# EAGLE schematic st32 (EAGLE 6.5.0)

## Sheet 1 of 3: IC mit Kommunikation
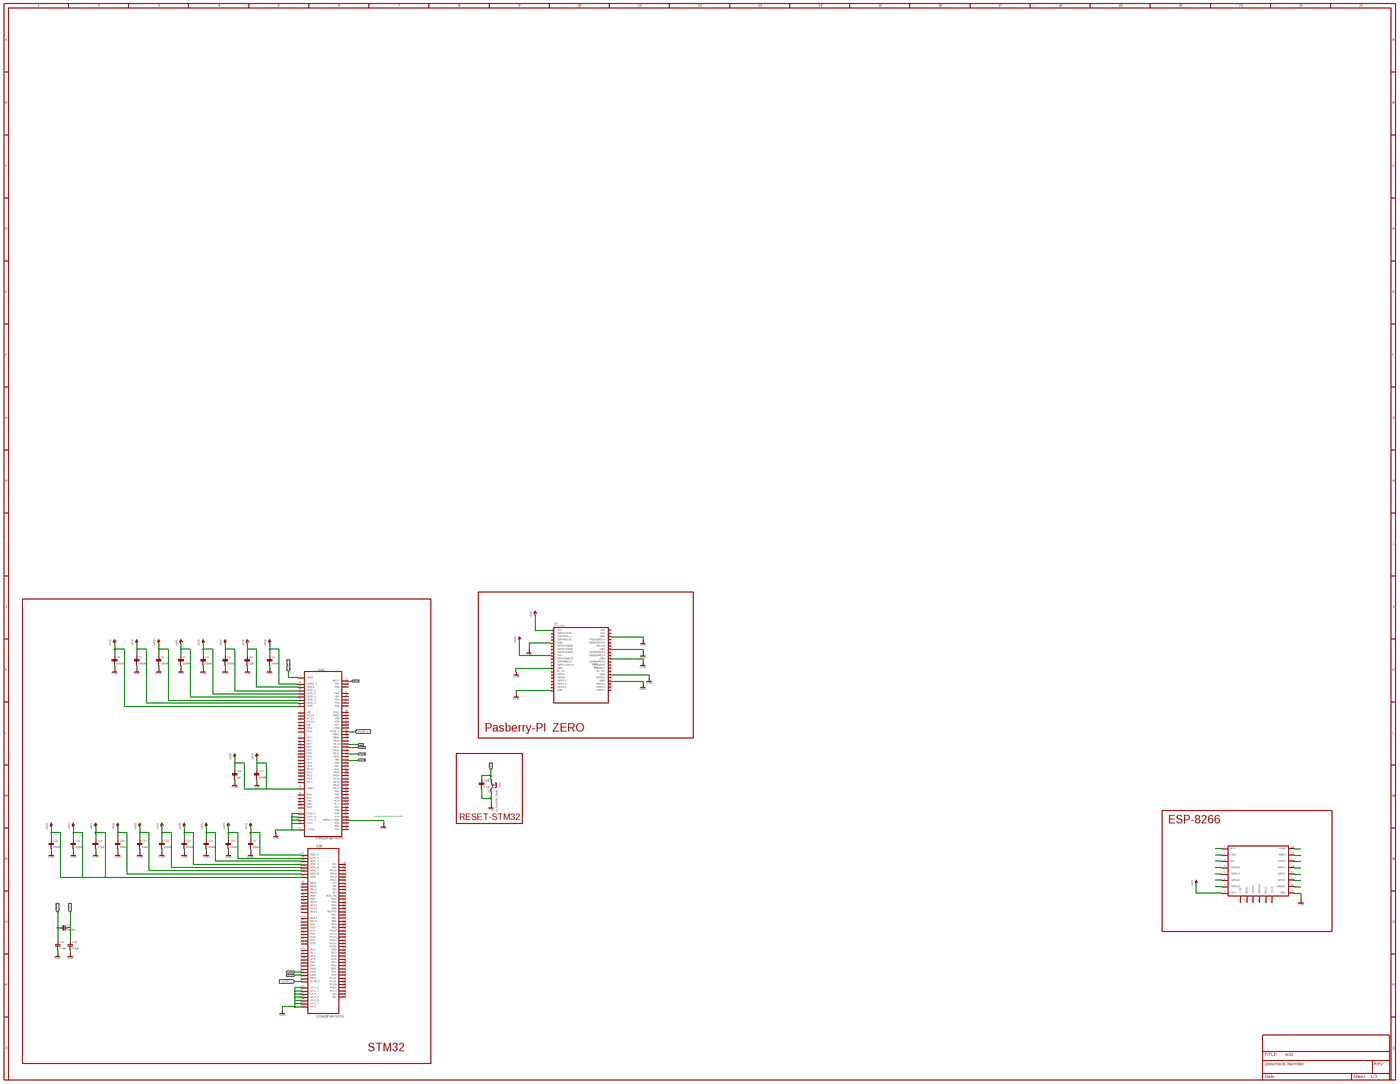
[diagram p0: schematic, sheet 1, overview]
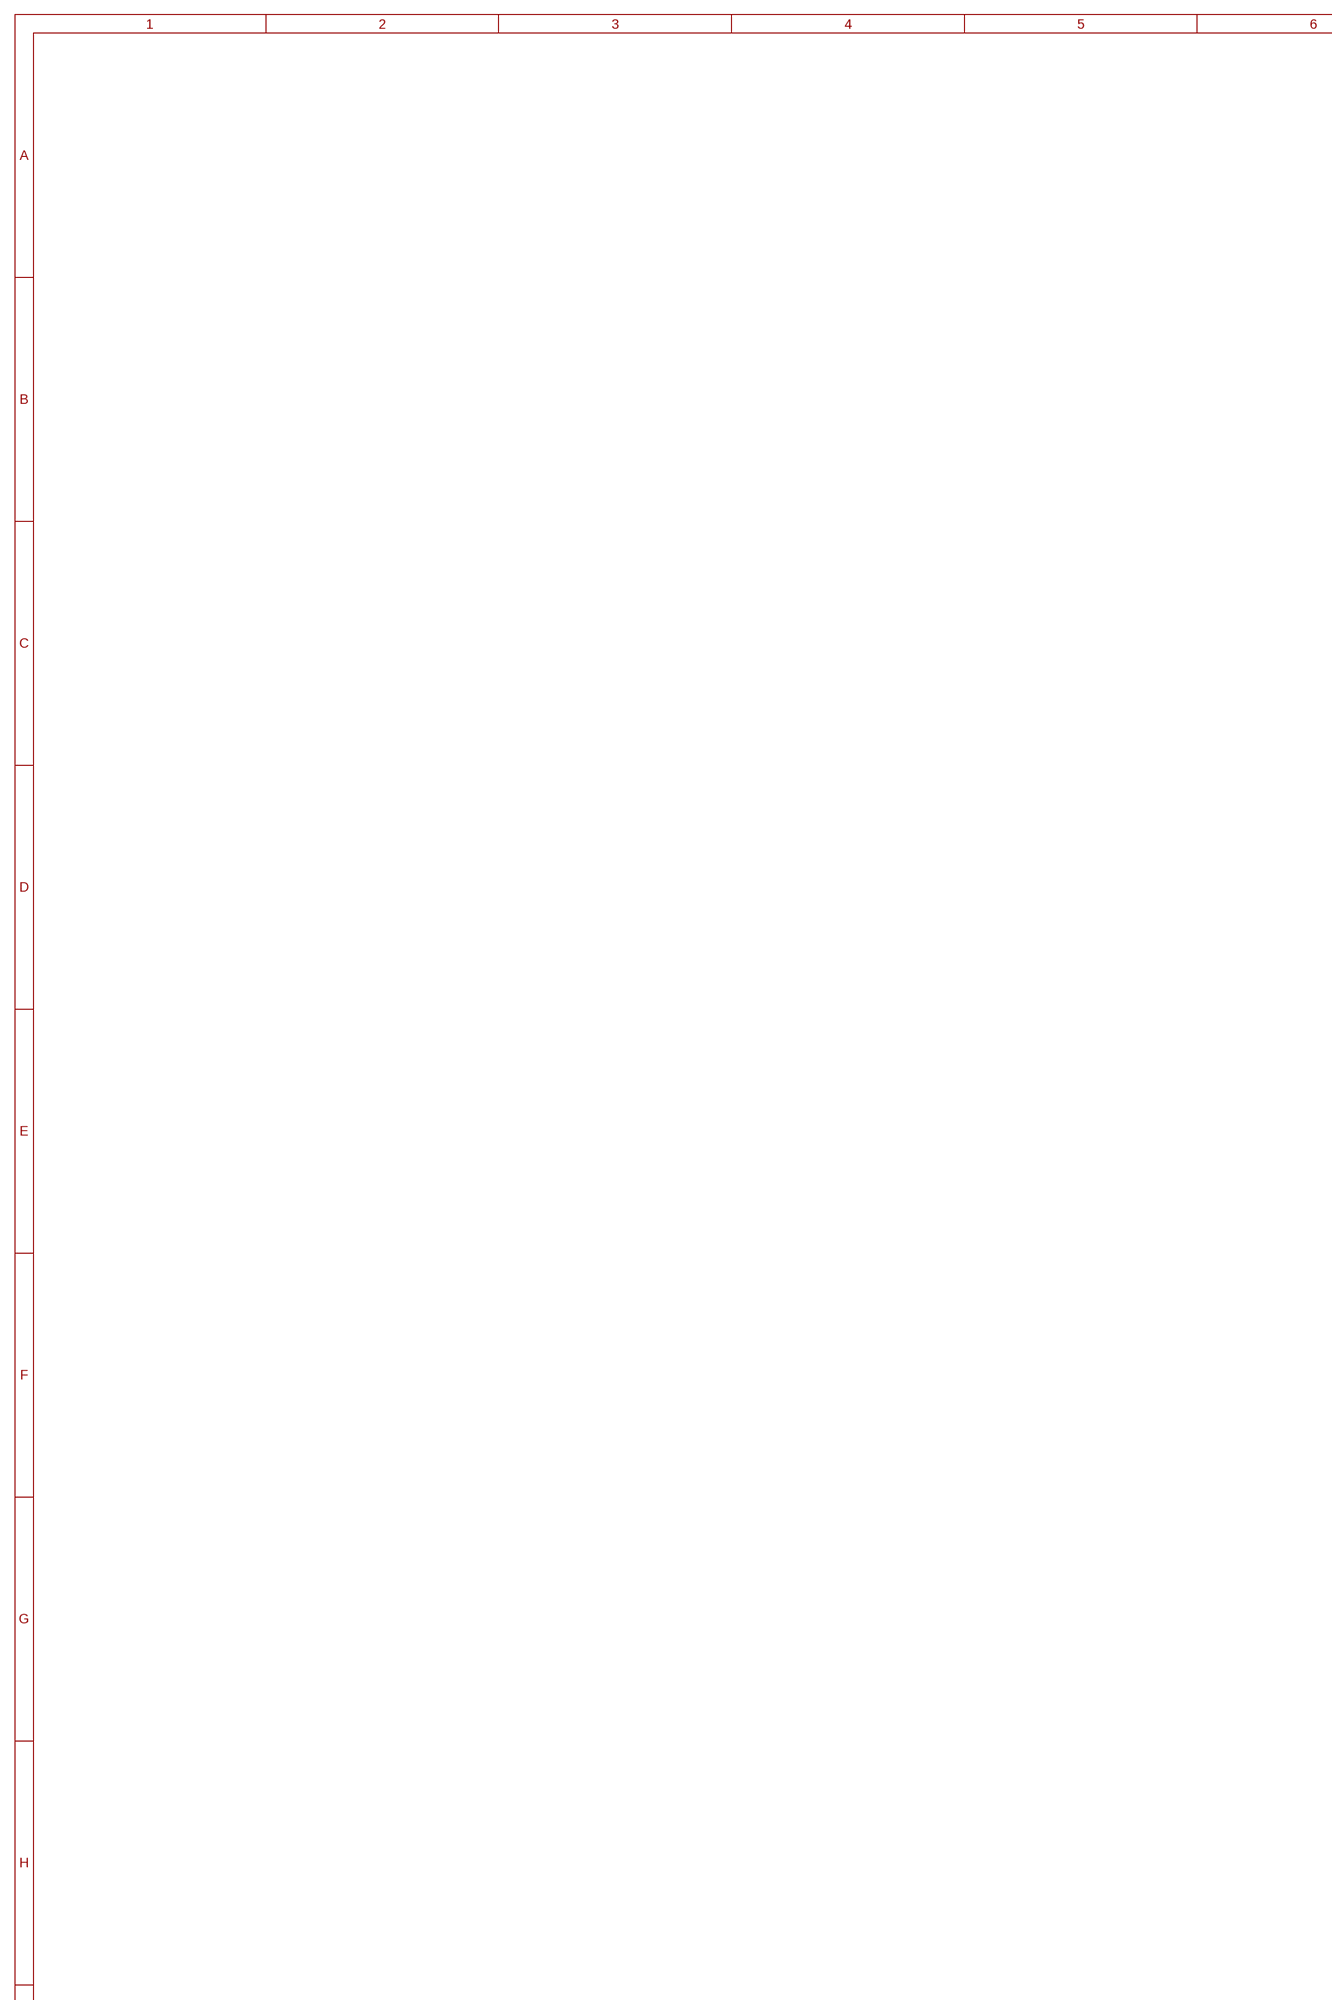
[diagram p1: schematic, sheet 1, part 1 of 7]
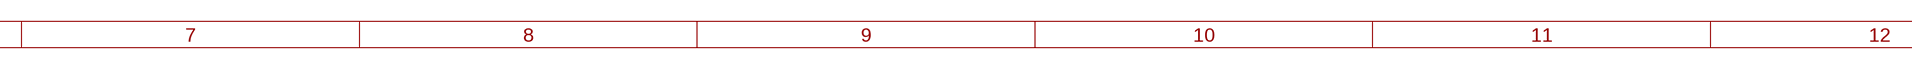
[diagram p2: schematic, sheet 1, part 2 of 7]
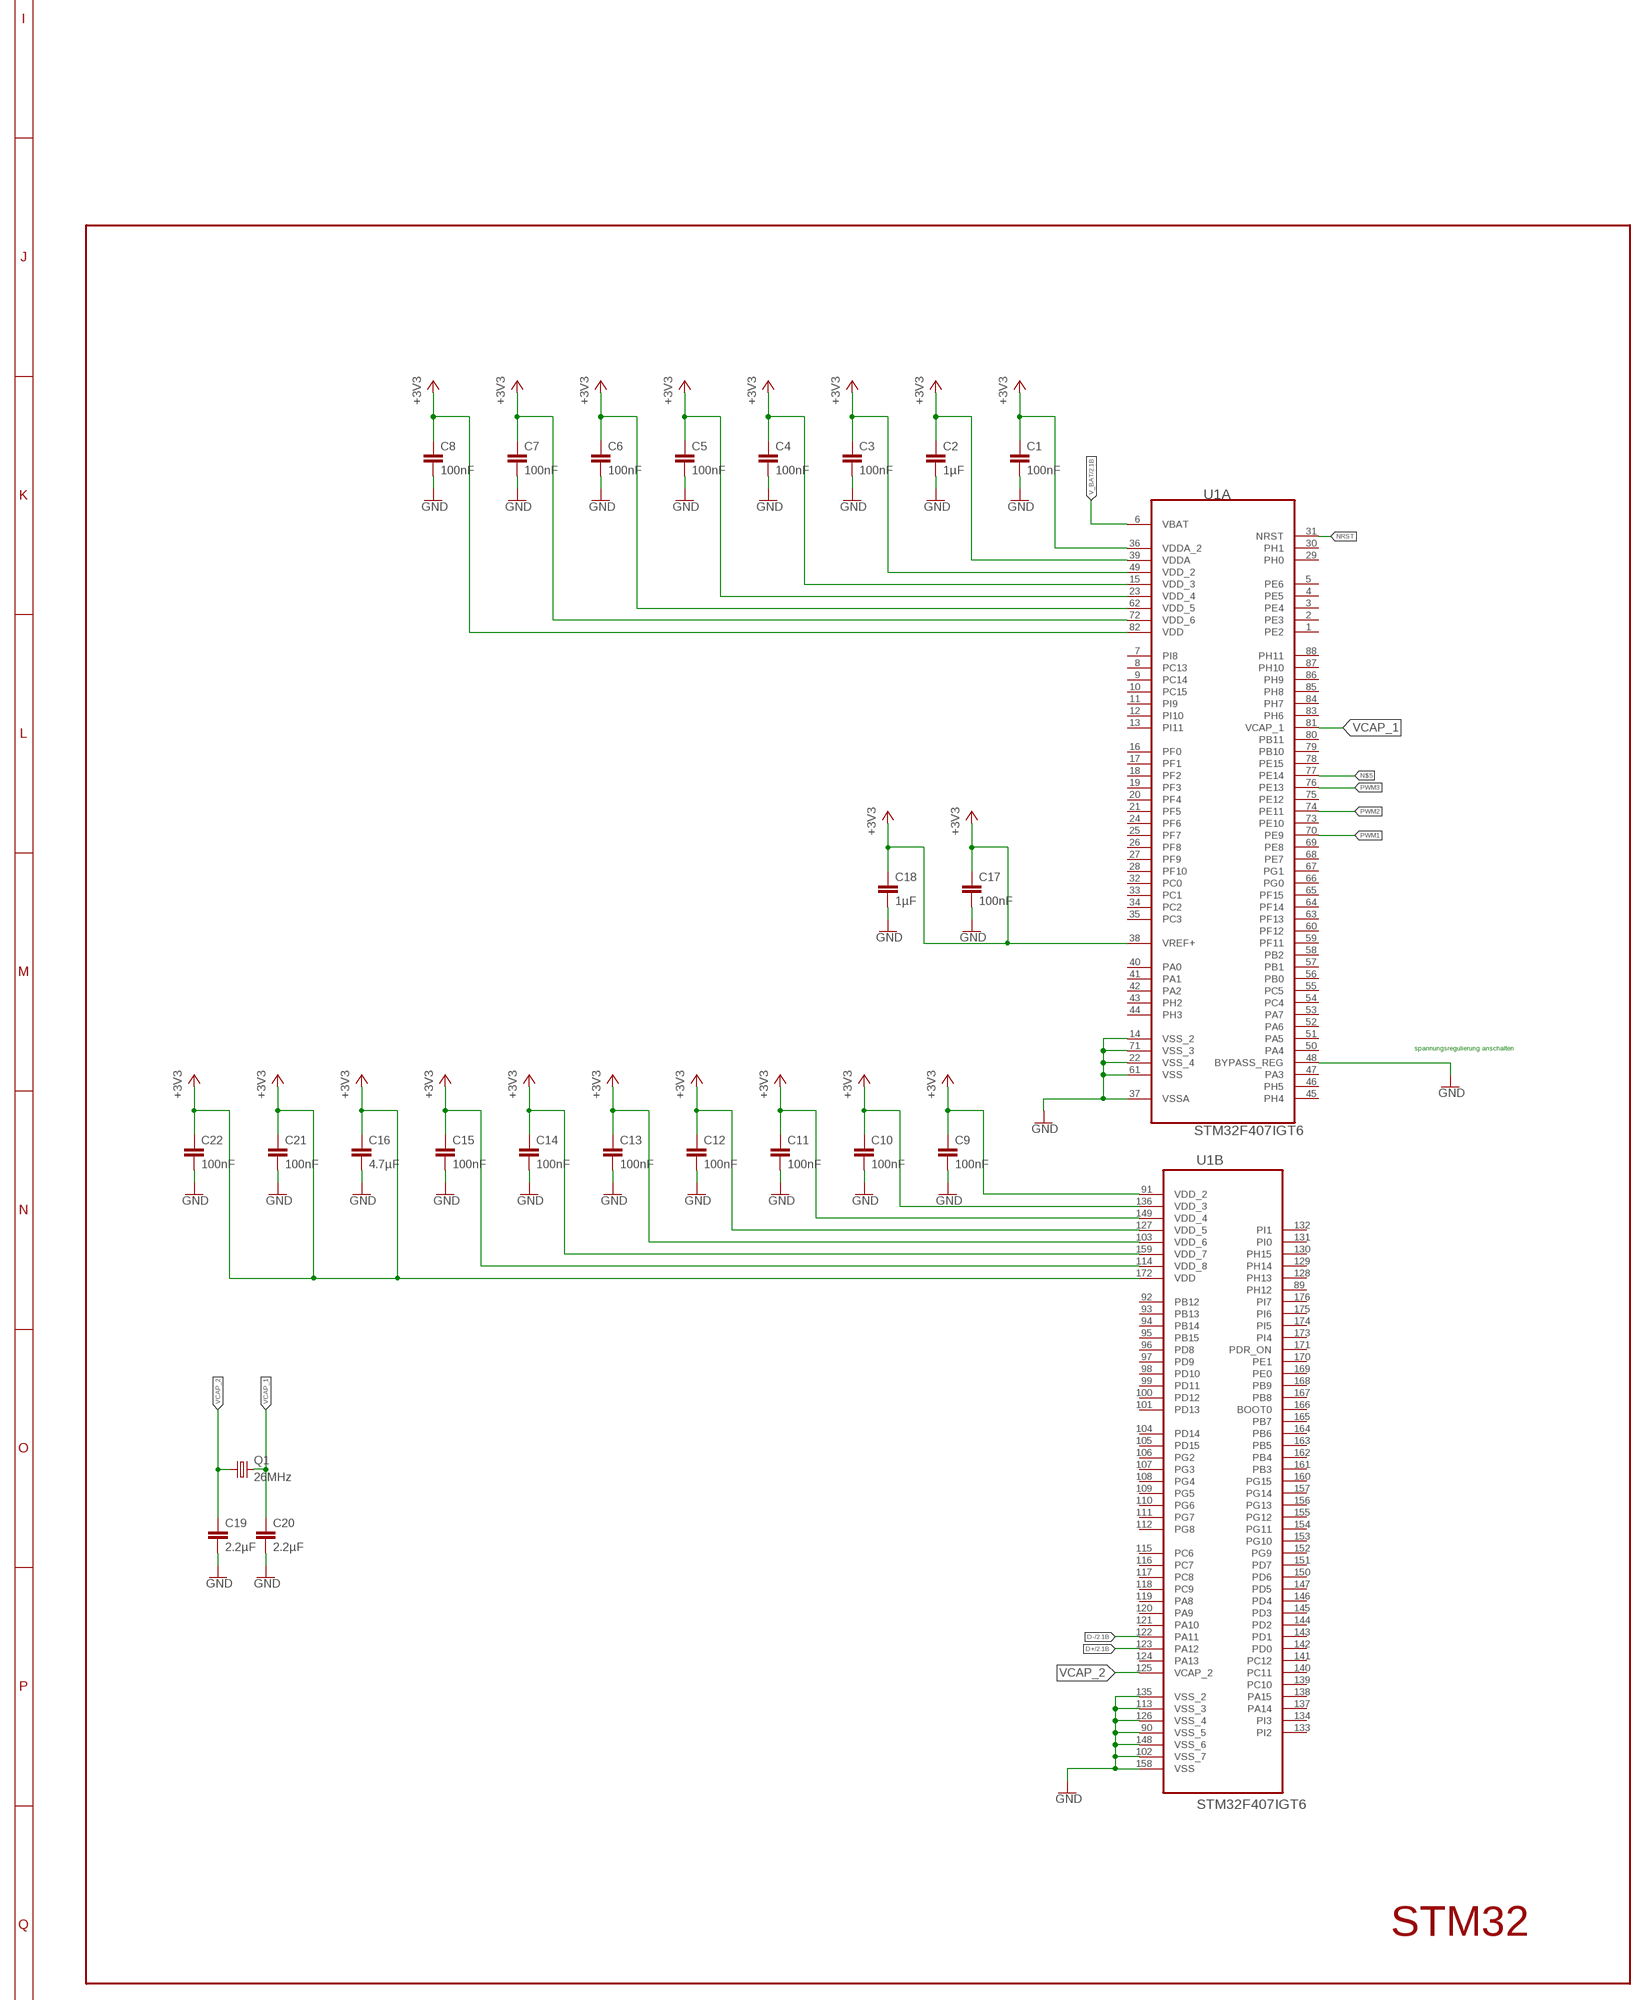
[diagram p3: schematic, sheet 1, part 3 of 7]
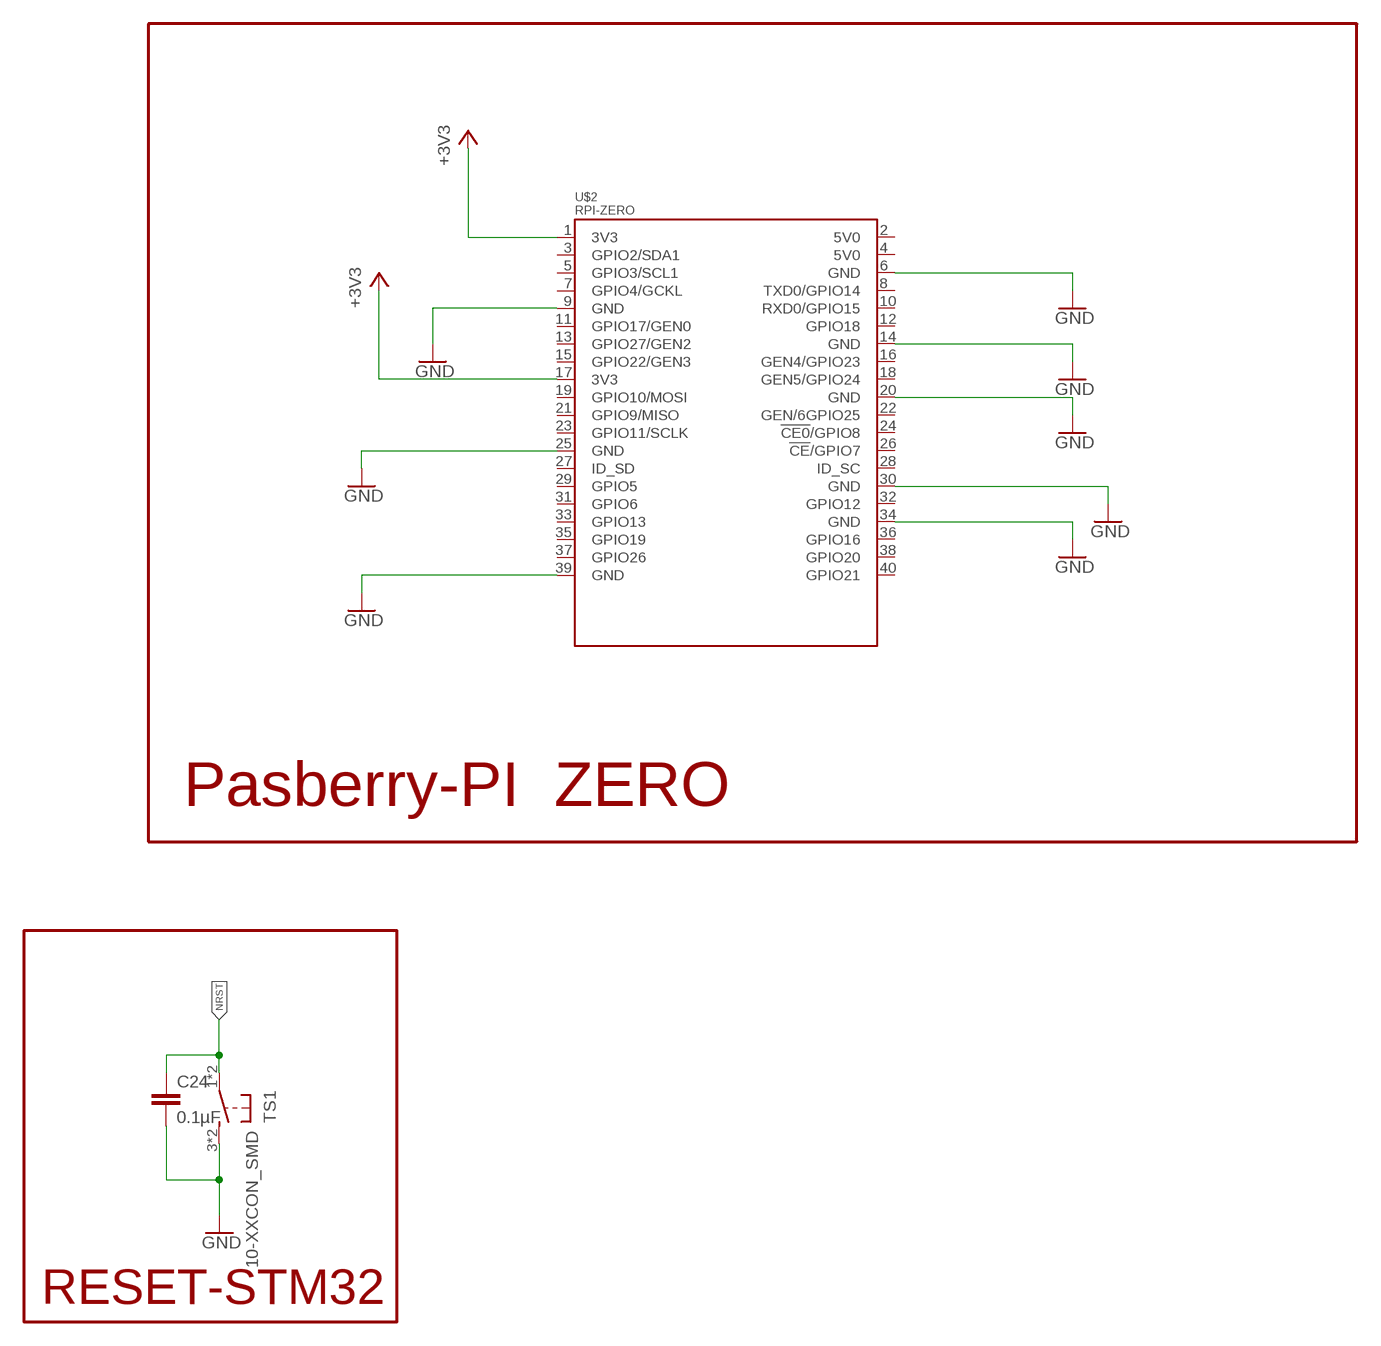
[diagram p4: schematic, sheet 1, part 4 of 7]
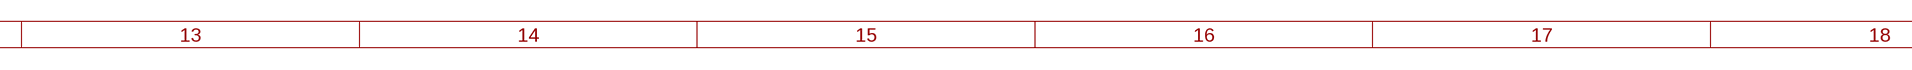
[diagram p5: schematic, sheet 1, part 5 of 7]
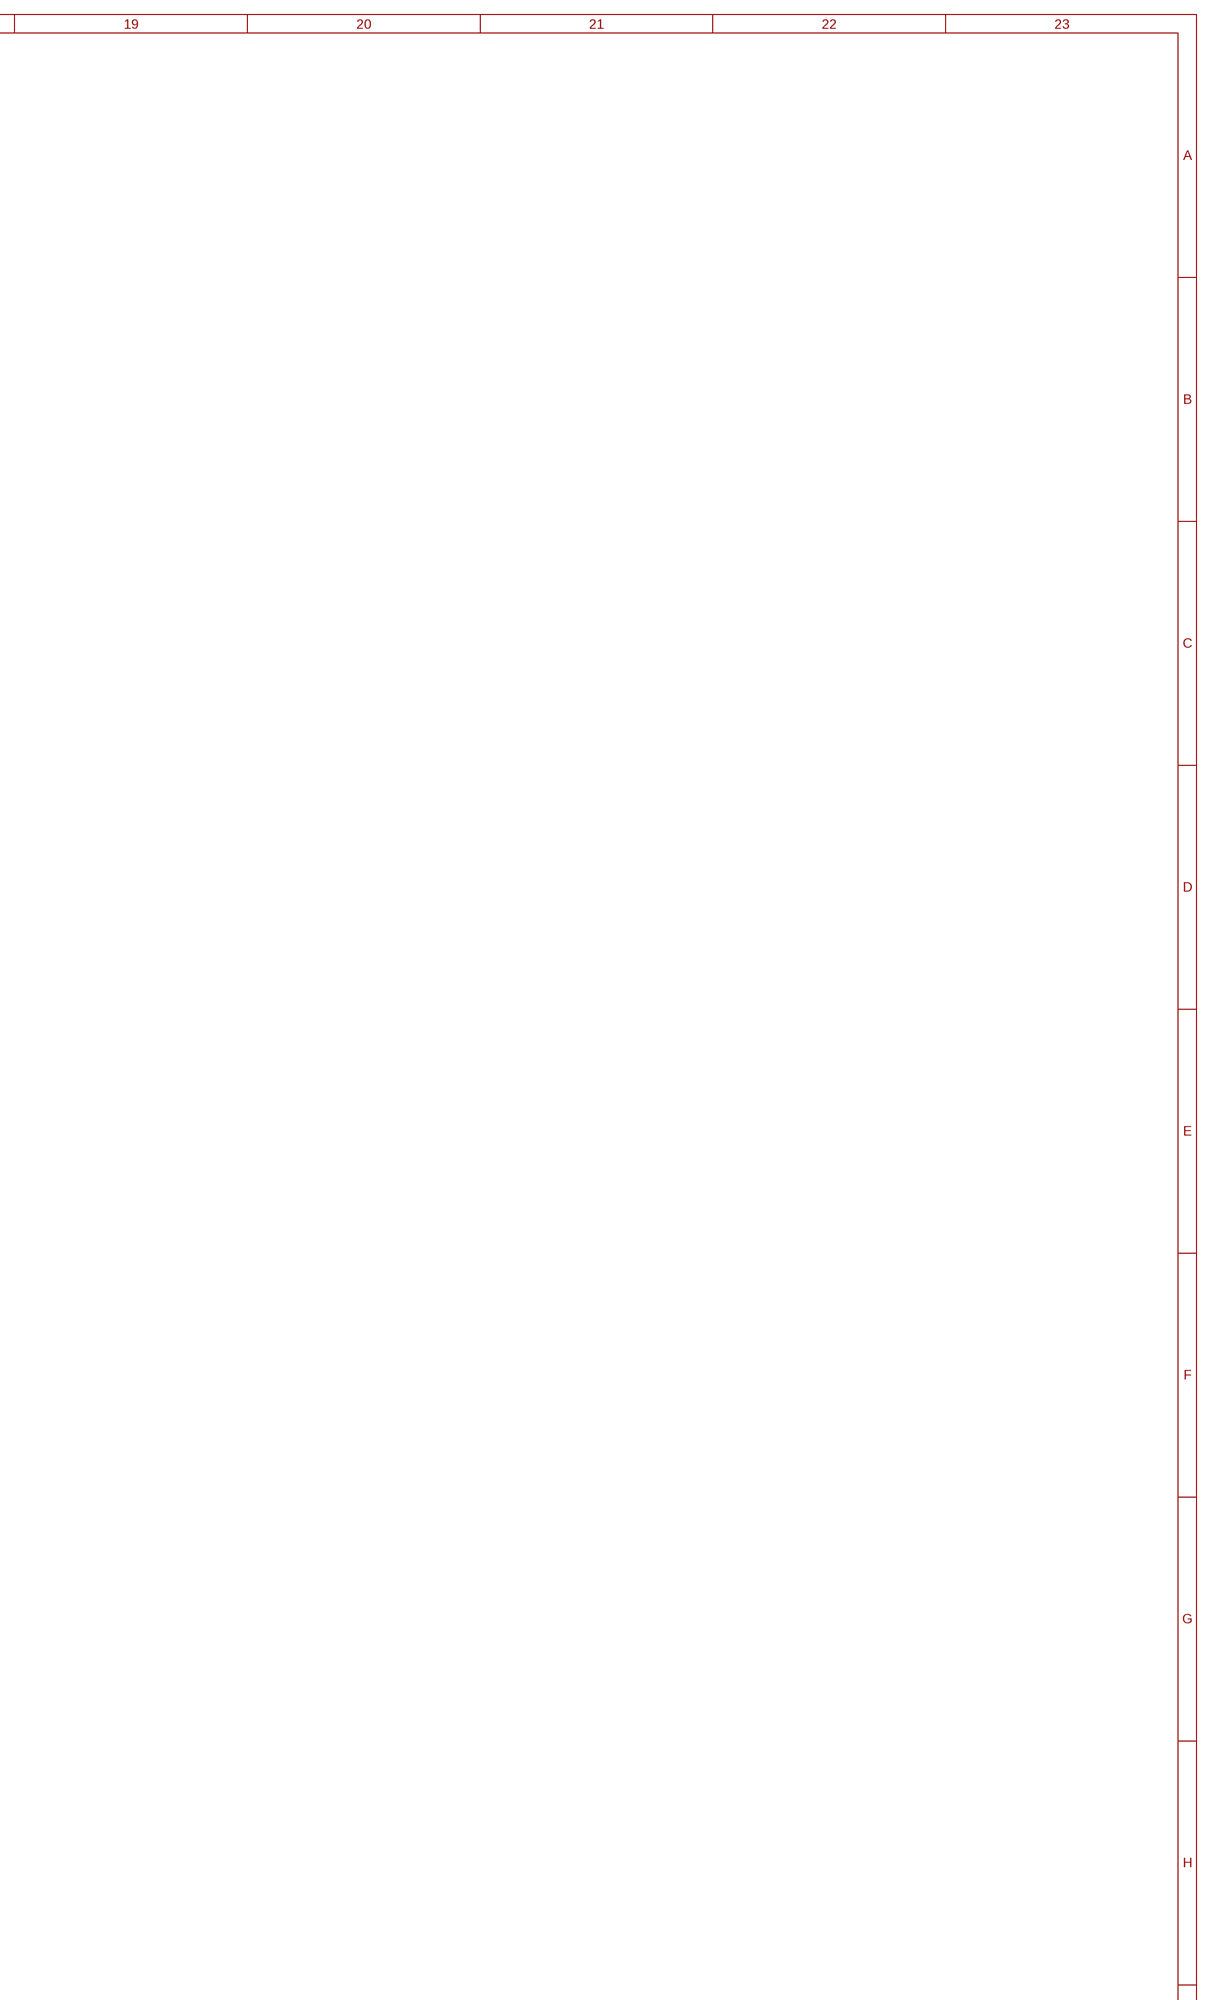
[diagram p6: schematic, sheet 1, part 6 of 7]
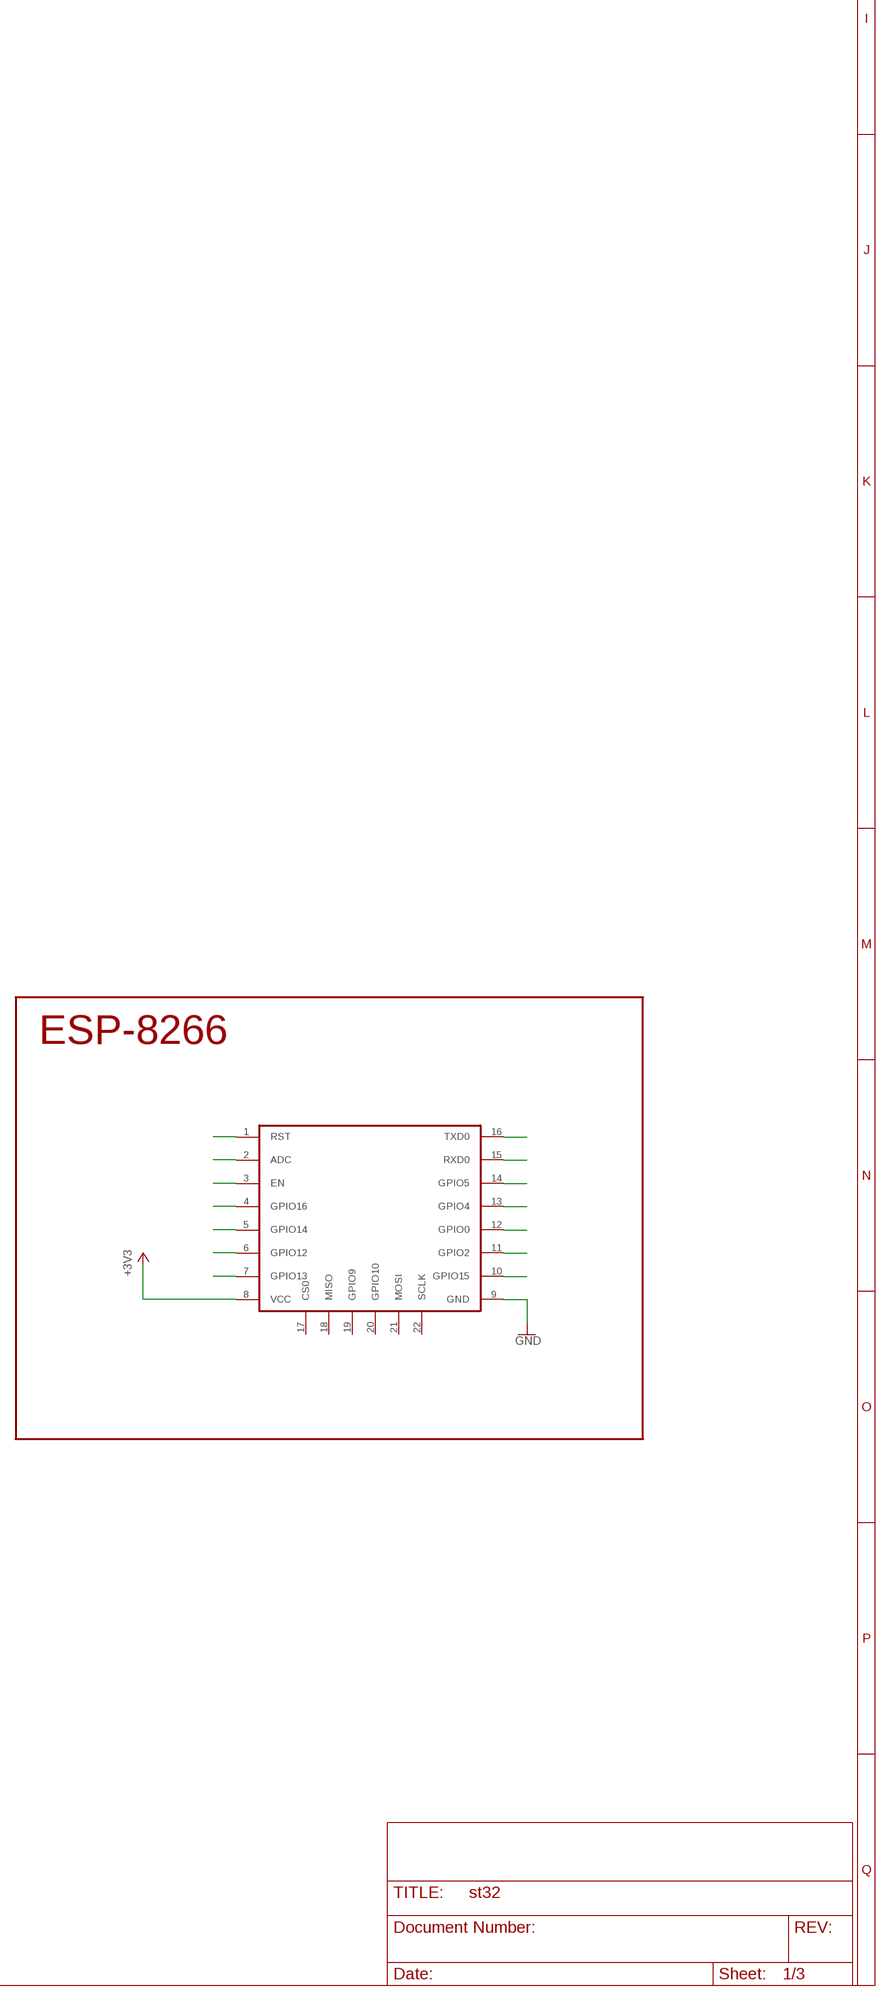
[diagram p7: schematic, sheet 1, part 7 of 7]

### Parts
C1  100nF  C-EUC0603  [C0603]
C2  1µF  C-EUC0603  [C0603]
C3  100nF  C-EUC0603  [C0603]
C4  100nF  C-EUC0603  [C0603]
C5  100nF  C-EUC0603  [C0603]
C6  100nF  C-EUC0603  [C0603]
C7  100nF  C-EUC0603  [C0603]
C8  100nF  C-EUC0603  [C0603]
C9  100nF  C-EUC0603  [C0603]
C10  100nF  C-EUC0603  [C0603]
C11  100nF  C-EUC0603  [C0603]
C12  100nF  C-EUC0603  [C0603]
C13  100nF  C-EUC0603  [C0603]
C14  100nF  C-EUC0603  [C0603]
C15  100nF  C-EUC0603  [C0603]
C16  4.7µF  C-EUC0603  [C0603]
C17  100nF  C-EUC0603  [C0603]
C18  1µF  C-EUC0603  [C0603]
C19  2.2µF  C-EUC0603  [C0603]
C20  2.2µF  C-EUC0603  [C0603]
C21  100nF  C-EUC0603  [C0603]
C22  100nF  C-EUC0603  [C0603]
C24  0.1µF  C-EUC0603  [C0603]
Q1  26MHz  CRYSTALHC49UP  [HC49UP]
TS1  10-XXCON_SMD  [SKHMPXE010]
U1  STM32F407IGT6  [QFP50P2600X2600X160-176N]
U$1  ESP8266  [ESP8266-SMT]
U$2  RPI-ZERO  [RASPBERRYPI_BASTELSTUBE_V13_RASPI_BOARD_B+_FULL]

### Nets
+3V3: C1.1 C2.1 C3.1 C4.1 C5.1 C6.1 C7.1 C8.1 C9.1 C10.1 C11.1 C12.1 C13.1 C14.1 C15.1 C16.1 C17.1 C18.1 C21.1 C22.1 U1.15(A:VDD_3) U1.23(A:VDD_4) U1.36(A:VDDA_2) U1.38(A:VREF+) U1.39(A:VDDA) U1.49(A:VDD_2) U1.62(A:VDD_5) U1.72(A:VDD_6) U1.82(A:VDD) U1.91(B:VDD_2) U1.103(B:VDD_6) U1.114(B:VDD_8) U1.127(B:VDD_5) U1.136(B:VDD_3) U1.149(B:VDD_4) U1.159(B:VDD_7) U1.172(B:VDD) U$1.8(VCC) U$2.1(3V3) U$2.17(3V3) ; also sheet 2
D+: U1.123(B:PA12) ; also sheet 2
D-: U1.122(B:PA11) ; also sheet 2
GND_PWR: C1.2 C2.2 C3.2 C4.2 C5.2 C6.2 C7.2 C8.2 C9.2 C10.2 C11.2 C12.2 C13.2 C14.2 C15.2 C16.2 C17.2 C18.2 C19.2 C20.2 C21.2 C22.2 C24.2 TS1.3(S) TS1.4(S) U1.14(A:VSS_2) U1.22(A:VSS_4) U1.37(A:VSSA) U1.48(A:BYPASS_REG) U1.61(A:VSS) U1.71(A:VSS_3) U1.90(B:VSS_5) U1.102(B:VSS_7) U1.113(B:VSS_3) U1.126(B:VSS_4) U1.135(B:VSS_2) U1.148(B:VSS_6) U1.158(B:VSS) U$1.9(GND) U$2.6(GND) U$2.9(GND) U$2.14(GND) U$2.20(GND) U$2.25(GND) U$2.30(GND) U$2.34(GND) U$2.39(GND) ; supply symbol labelled GND ; also sheet 2
N$3: U$1.1(RST)
N$4: U$1.2(ADC)
N$5: U1.77(A:PE14)
N$6: U$1.3(EN)
N$7: U$1.4(GPIO16)
N$8: U$1.5(GPIO14)
N$9: U$1.6(GPIO12)
N$10: U$1.7(GPIO13)
N$11: U$1.16(TXD0)
N$12: U$1.15(RXD0)
N$13: U$1.14(GPIO5)
N$14: U$1.13(GPIO4)
N$15: U$1.12(GPIO0)
N$16: U$1.11(GPIO2)
N$17: U$1.10(GPIO15)
NRST: C24.1 TS1.1(P) TS1.2(P) U1.31(A:NRST)
PWM1: U1.70(A:PE9)
PWM2: U1.74(A:PE11)
PWM3: U1.76(A:PE13)
V_BAT: U1.6(A:VBAT) ; also sheet 2
VCAP_1: C20.1 Q1.2 U1.81(A:VCAP_1)
VCAP_2: C19.1 Q1.1 U1.125(B:VCAP_2)
Unconnected: U1.1(A:PE2) U1.2(A:PE3) U1.3(A:PE4) U1.4(A:PE5) U1.5(A:PE6) U1.7(A:PI8) U1.8(A:PC13) U1.9(A:PC14) U1.10(A:PC15) U1.11(A:PI9) U1.12(A:PI10) U1.13(A:PI11) U1.16(A:PF0) U1.17(A:PF1) U1.18(A:PF2) U1.19(A:PF3) U1.20(A:PF4) U1.21(A:PF5) U1.24(A:PF6) U1.25(A:PF7) U1.26(A:PF8) U1.27(A:PF9) U1.28(A:PF10) U1.29(A:PH0) U1.30(A:PH1) U1.32(A:PC0) U1.33(A:PC1) U1.34(A:PC2) U1.35(A:PC3) U1.40(A:PA0) U1.41(A:PA1) U1.42(A:PA2) U1.43(A:PH2) U1.44(A:PH3) U1.45(A:PH4) U1.46(A:PH5) U1.47(A:PA3) U1.50(A:PA4) U1.51(A:PA5) U1.52(A:PA6) U1.53(A:PA7) U1.54(A:PC4) U1.55(A:PC5) U1.56(A:PB0) U1.57(A:PB1) U1.58(A:PB2) U1.59(A:PF11) U1.60(A:PF12) U1.63(A:PF13) U1.64(A:PF14) U1.65(A:PF15) U1.66(A:PG0) U1.67(A:PG1) U1.68(A:PE7) U1.69(A:PE8) U1.73(A:PE10) U1.75(A:PE12) U1.78(A:PE15) U1.79(A:PB10) U1.80(A:PB11) U1.83(A:PH6) U1.84(A:PH7) U1.85(A:PH8) U1.86(A:PH9) U1.87(A:PH10) U1.88(A:PH11) U1.89(B:PH12) U1.92(B:PB12) U1.93(B:PB13) U1.94(B:PB14) U1.95(B:PB15) U1.96(B:PD8) U1.97(B:PD9) U1.98(B:PD10) U1.99(B:PD11) U1.100(B:PD12) U1.101(B:PD13) U1.104(B:PD14) U1.105(B:PD15) U1.106(B:PG2) U1.107(B:PG3) U1.108(B:PG4) U1.109(B:PG5) U1.110(B:PG6) U1.111(B:PG7) U1.112(B:PG8) U1.115(B:PC6) U1.116(B:PC7) U1.117(B:PC8) U1.118(B:PC9) U1.119(B:PA8) U1.120(B:PA9) U1.121(B:PA10) U1.124(B:PA13) U1.128(B:PH13) U1.129(B:PH14) U1.130(B:PH15) U1.131(B:PI0) U1.132(B:PI1) U1.133(B:PI2) U1.134(B:PI3) U1.137(B:PA14) U1.138(B:PA15) U1.139(B:PC10) U1.140(B:PC11) U1.141(B:PC12) U1.142(B:PD0) U1.143(B:PD1) U1.144(B:PD2) U1.145(B:PD3) U1.146(B:PD4) U1.147(B:PD5) U1.150(B:PD6) U1.151(B:PD7) U1.152(B:PG9) U1.153(B:PG10) U1.154(B:PG11) U1.155(B:PG12) U1.156(B:PG13) U1.157(B:PG14) U1.160(B:PG15) U1.161(B:PB3) U1.162(B:PB4) U1.163(B:PB5) U1.164(B:PB6) U1.165(B:PB7) U1.166(B:BOOT0) U1.167(B:PB8) U1.168(B:PB9) U1.169(B:PE0) U1.170(B:PE1) U1.171(B:PDR_ON) U1.173(B:PI4) U1.174(B:PI5) U1.175(B:PI6) U1.176(B:PI7) U$1.17(CS0) U$1.18(MISO) U$1.19(GPIO9) U$1.20(GPIO10) U$1.21(MOSI) U$1.22(SCLK) U$2.2(5V0) U$2.3(GPIO2/SDA1) U$2.4(5V0) U$2.5(GPIO3/SCL1) U$2.7(GPIO4/GCKL) U$2.8(TXD0/GPIO14) U$2.10(RXD0/GPIO15) U$2.11(GPIO17/GEN0) U$2.12(GPIO18) U$2.13(GPIO27/GEN2) U$2.15(GPIO22/GEN3) U$2.16(GEN4/GPIO23) U$2.18(GEN5/GPIO24) U$2.19(GPIO10/MOSI) U$2.21(GPIO9/MISO) U$2.22(GEN/6GPIO25) U$2.23(GPIO11/SCLK) U$2.24(!CE0!/GPIO8) U$2.26(!CE!/GPIO7) U$2.27(ID_SD) U$2.28(ID_SC) U$2.29(GPIO5) U$2.31(GPIO6) U$2.32(GPIO12) U$2.33(GPIO13) U$2.35(GPIO19) U$2.36(GPIO16) U$2.37(GPIO26) U$2.38(GPIO20) U$2.40(GPIO21)

### Notes on the sheet
- Pasberry-PI  ZERO
- spannungsregulierung anschalten
- RESET-STM32
- ESP-8266
- STM32

## Sheet 2 of 3: Power Management
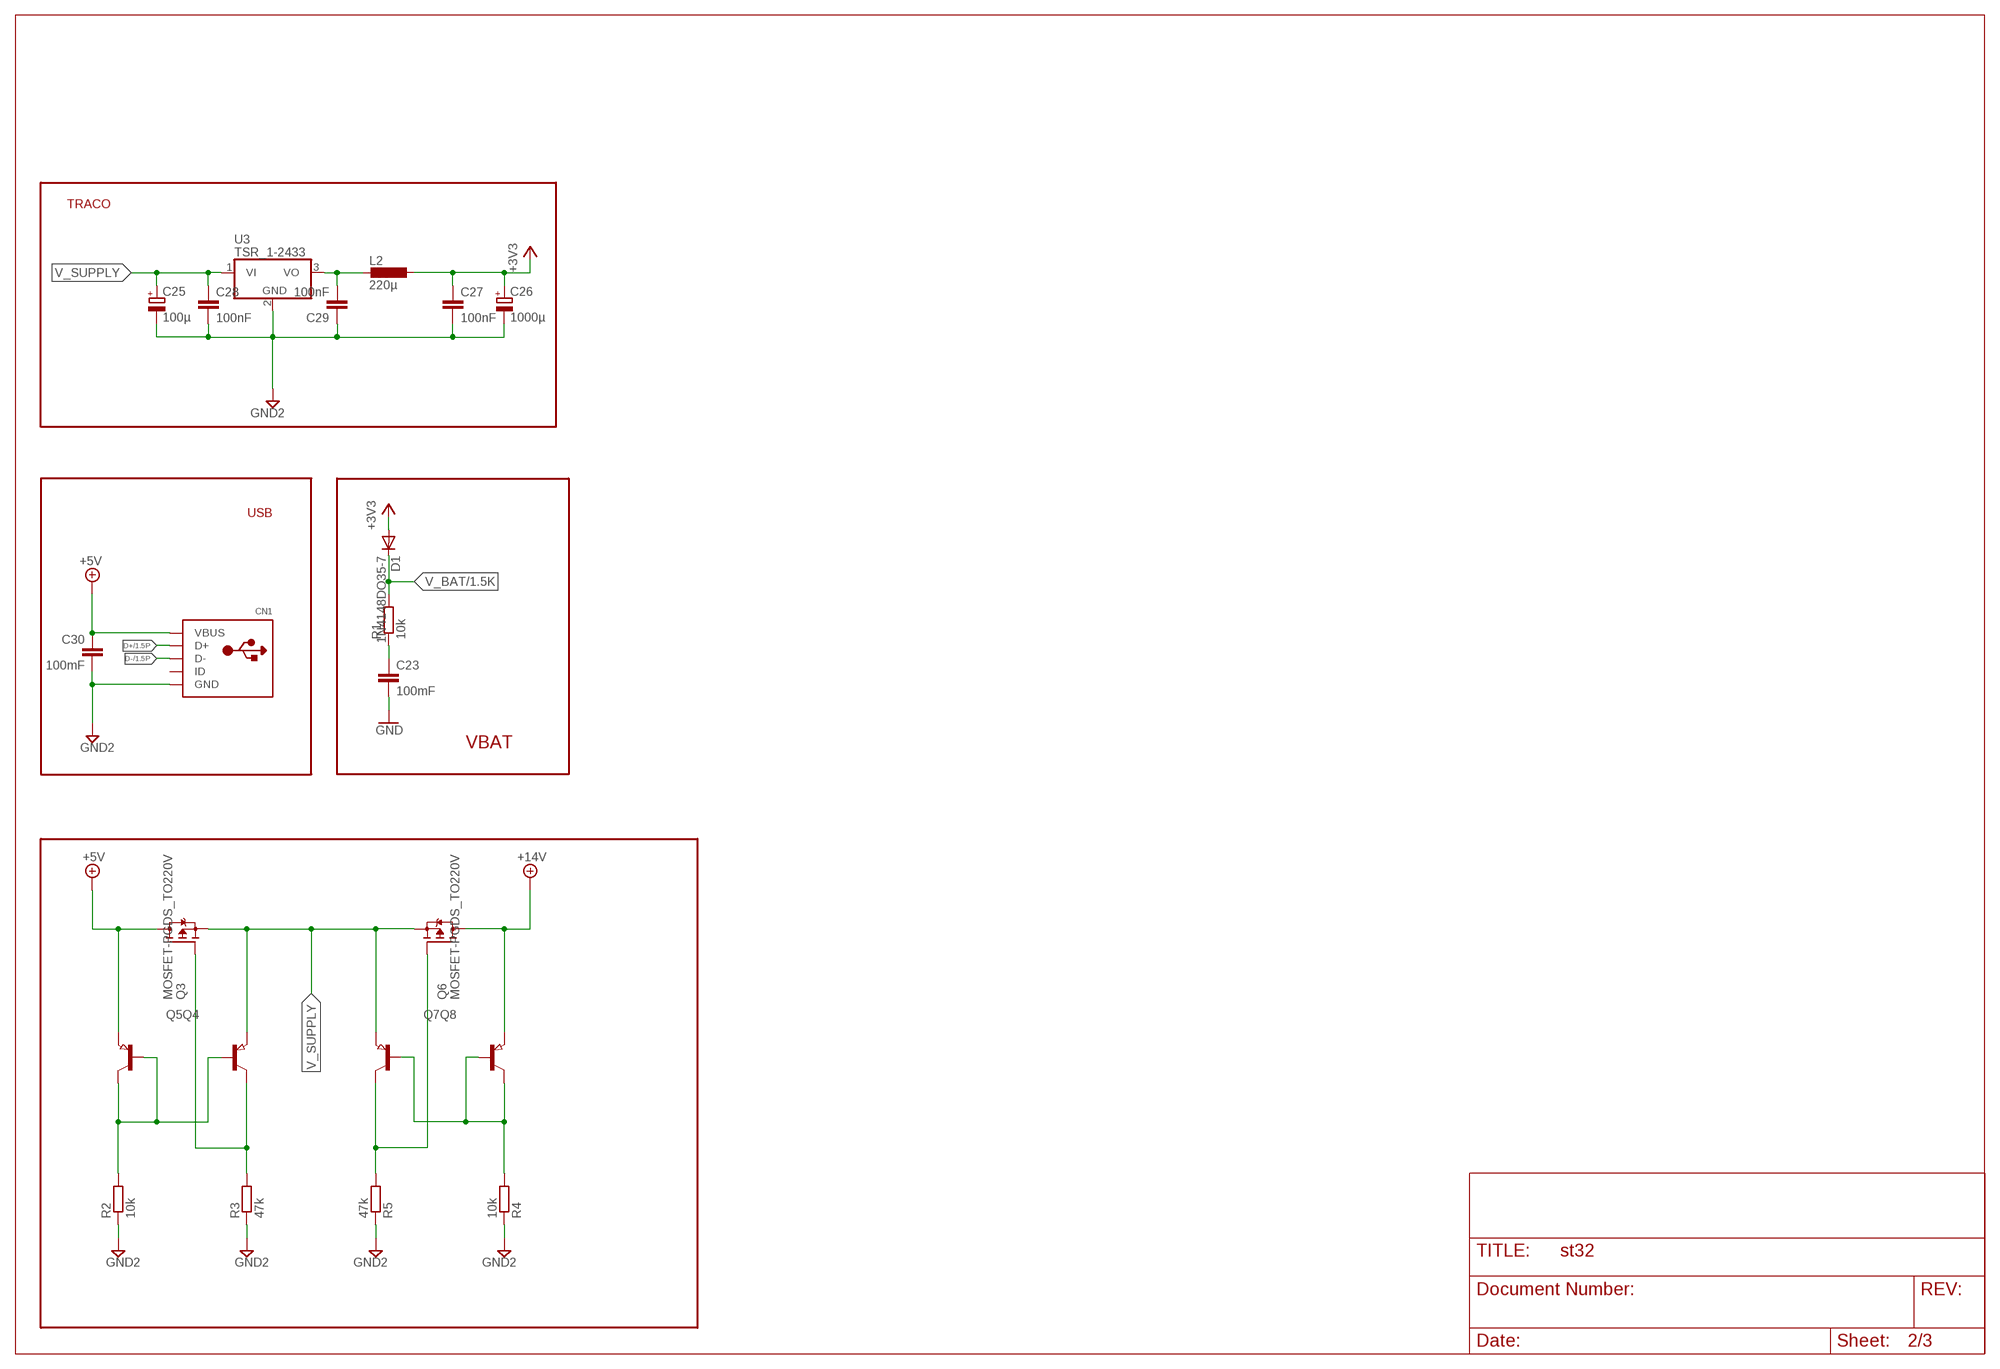
[diagram p8: schematic, sheet 2]

### Parts
C23  100mF  C-EUC0603  [C0603]
C25  100µ  CPOL-EUE2.5-6  [E2,5-6]
C26  1000µ  CPOL-EUE5-13  [E5-13]
C27  100nF  C-EUC1206  [C1206]
C28  100nF  C-EUC1206  [C1206]
C29  100nF  C-EUC1206  [C1206]
C30  100mF  C-EUC0603  [C0603]
CN1  USBMINIB  [USB-MINIB]
D1  1N4148DO35-7  [DO35-7]
L2  220µ  L-EUTJ3-U1  [TJ3-U1]
Q3  MOSFET-PGDS_TO220V  [TO220V]
Q4  PNP-TRANSISTOR_SOT23  [SOT23]
Q5  PNP-TRANSISTOR_SOT23  [SOT23]
Q6  MOSFET-PGDS_TO220V  [TO220V]
Q7  PNP-TRANSISTOR_SOT23  [SOT23]
Q8  PNP-TRANSISTOR_SOT23  [SOT23]
R1  10k  R-EU_R0603  [R0603]
R2  10k  R-EU_M1206  [M1206]
R3  47k  R-EU_M1206  [M1206]
R4  10k  R-EU_M1206  [M1206]
R5  47k  R-EU_M1206  [M1206]
U3  TSR_1-2433  [TSR-1]

### Nets
+3V3: C26.+ C27.1 D1.A L2.1 ; also sheet 1
+5V: C30.1 CN1.VBUS Q3.2(D) Q5.2(E)
+14V: Q6.2(D) Q8.2(E) ; also sheet 3
D+: CN1.D+ ; also sheet 1
D-: CN1.D- ; also sheet 1
GND2: C25.- C26.- C27.2 C28.2 C29.1 C30.2 CN1.GND R2.1 R3.1 R4.1 R5.1 U3.2(GND)
GND_PWR: C23.2 ; supply symbol labelled GND ; also sheet 1
N$1: C23.1 R1.1
N$18: Q4.1(B) Q5.1(B) Q5.3(C) R2.2
N$19: Q3.1(G) Q4.3(C) R3.2
N$21: Q7.1(B) Q8.1(B) Q8.3(C) R4.2
N$22: Q6.1(G) Q7.3(C) R5.2
N$37: C29.2 L2.2 U3.3(VO)
V_BAT: D1.C R1.2 ; also sheet 1
V_SUPPLY: C25.+ C28.1 Q3.3(S) Q4.2(E) Q6.3(S) Q7.2(E) U3.1(VI)
Unconnected: CN1.ID

### Notes on the sheet
- TRACO
- USB
- VBAT

## Sheet 3 of 3: Motor etc.
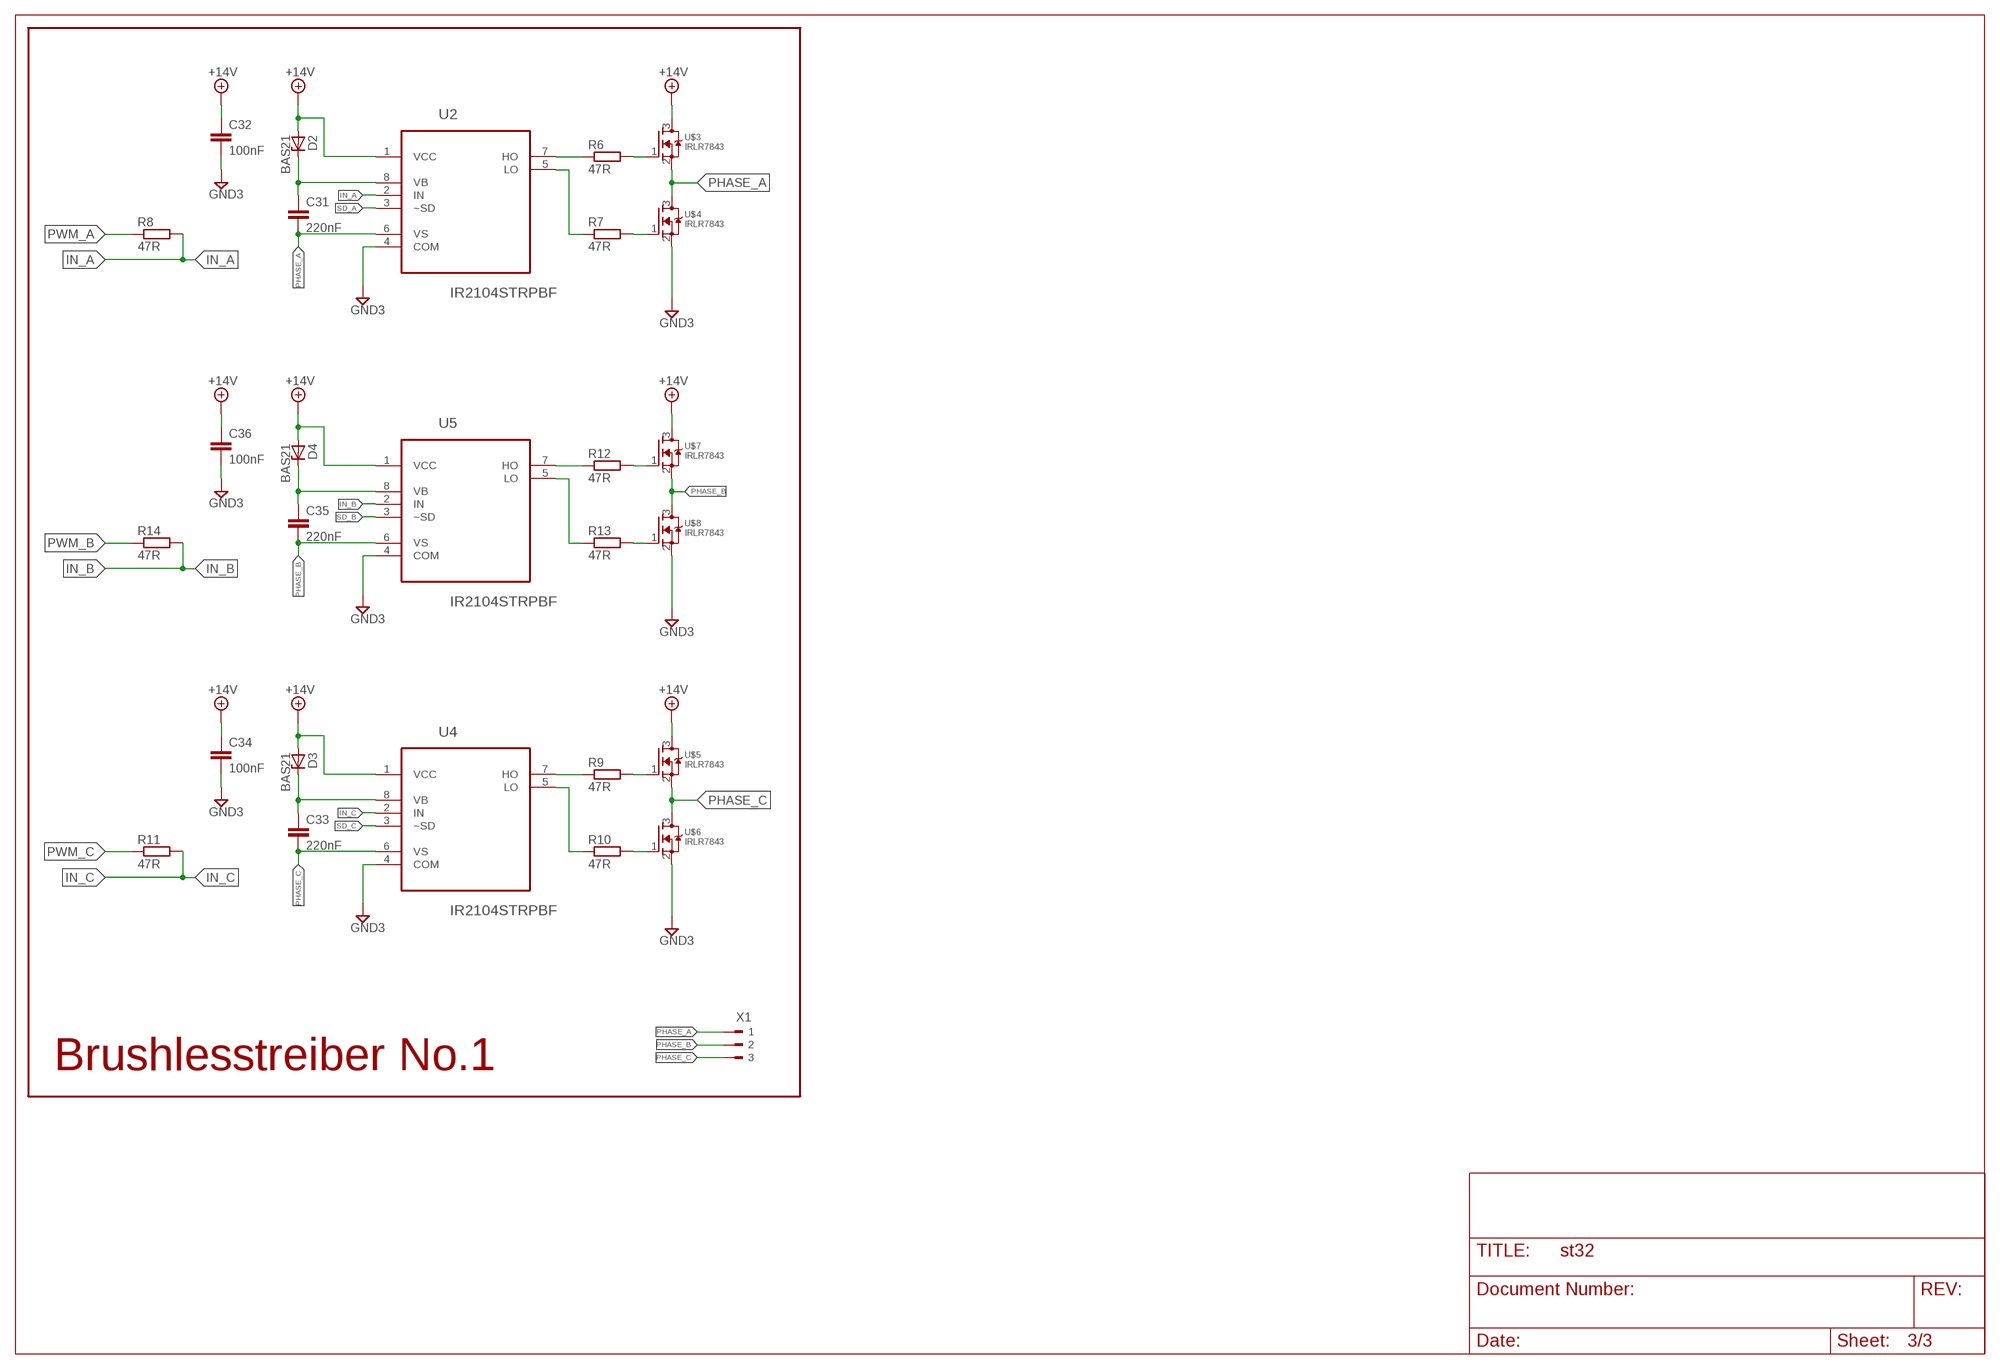
[diagram p9: schematic, sheet 3]

### Parts
C31  220nF  C-EUC0805  [C0805]
C32  100nF  C-EUC0805  [C0805]
C33  220nF  C-EUC0805  [C0805]
C34  100nF  C-EUC0805  [C0805]
C35  220nF  C-EUC0805  [C0805]
C36  100nF  C-EUC0805  [C0805]
D2  BAS21  ZENER-DIODESOT23  [SOT23]
D3  BAS21  ZENER-DIODESOT23  [SOT23]
D4  BAS21  ZENER-DIODESOT23  [SOT23]
R6  47R  R-EU_M0805  [M0805]
R7  47R  R-EU_M0805  [M0805]
R8  47R  R-EU_M0805  [M0805]
R9  47R  R-EU_M0805  [M0805]
R10  47R  R-EU_M0805  [M0805]
R11  47R  R-EU_M0805  [M0805]
R12  47R  R-EU_M0805  [M0805]
R13  47R  R-EU_M0805  [M0805]
R14  47R  R-EU_M0805  [M0805]
U2  IR2104STRPBF  [SOIC127P600X175-8N]
U4  IR2104STRPBF  [SOIC127P600X175-8N]
U5  IR2104STRPBF  [SOIC127P600X175-8N]
U$3  IRLR7843  [D-PACK]
U$4  IRLR7843  [D-PACK]
U$5  IRLR7843  [D-PACK]
U$6  IRLR7843  [D-PACK]
U$7  IRLR7843  [D-PACK]
U$8  IRLR7843  [D-PACK]
X1  90-3  [90-3]

### Nets
+14V: C32.1 C34.1 C36.1 D2.1(A) D3.1(A) D4.1(A) U2.1(VCC) U4.1(VCC) U5.1(VCC) U$3.3(D) U$5.3(D) U$7.3(D) ; also sheet 2
GND3: C32.2 C34.2 C36.2 U2.4(COM) U4.4(COM) U5.4(COM) U$4.2(S) U$6.2(S) U$8.2(S)
IN_A: R8.2 U2.2(IN)
IN_B: R14.2 U5.2(IN)
IN_C: R11.2 U4.2(IN)
N$2: R6.2 U$3.1(G)
N$20: C31.1 D2.3(C) U2.8(VB)
N$23: R7.1 U2.5(LO)
N$24: R6.1 U2.7(HO)
N$25: R7.2 U$4.1(G)
N$26: C33.1 D3.3(C) U4.8(VB)
N$27: R10.1 U4.5(LO)
N$28: R9.1 U4.7(HO)
N$29: R10.2 U$6.1(G)
N$30: R9.2 U$5.1(G)
N$31: C35.1 D4.3(C) U5.8(VB)
N$32: R13.1 U5.5(LO)
N$33: R12.1 U5.7(HO)
N$34: R13.2 U$8.1(G)
N$35: R12.2 U$7.1(G)
PHASE_A: C31.2 U2.6(VS) U$3.2(S) U$4.3(D) X1.1
PHASE_B: C35.2 U5.6(VS) U$7.2(S) U$8.3(D) X1.2
PHASE_C: C33.2 U4.6(VS) U$5.2(S) U$6.3(D) X1.3
PWM_A: R8.1
PWM_B: R14.1
PWM_C: R11.1
SD_A: U2.3(~SD)
SD_B: U5.3(~SD)
SD_C: U4.3(~SD)

### Notes on the sheet
- Brushlesstreiber No.1

## Library data of the parts
C1-C24 C27-C36 = resistor:C-EU: CAPACITOR, European symbol
C25 C26 = resistor:CPOL-EU: POLARIZED CAPACITOR, European symbol
CN1 = adafruit:USB: USB Connectors USBMINIB - Surface Mount Female Mini-B USB Connector 4UConnector: 06564 By microbuilder.eu Thru-hole RA Female Mini-B USB Connector 4UConnector: 18732 By ladyada.net
D1 = diode:1N4148: DIODE high speed (Philips)
D2-D4 = diode:ZENER-DIODE: Z-Diode
L2 = resistor:L-EU: INDUCTOR, European symbol
Q1 = crystal:CRYSTAL: CRYSTAL; OC_FARNELL: unknown; OC_NEWARK: unknown
Q3 Q6 = adafruit:MOSFET-P
Q4 Q5 Q7 Q8 = semicon-smd-ipc:PNP-TRANSISTOR_: PNP TRANSISTOR
R1-R14 = resistor:R-EU_: RESISTOR, European symbol
TS1 = 1_Robo-Lib:10-XXCON: Switch with/without Connect-Through
U1 = STM32F40:STM32F407IGT6: IC, MCU, 32BIT, 1MB FLASH, 176LQFP; MPN: STM32F407IGT6; OC_FARNELL: 2064366; OC_NEWARK: 73T2331; PACKAGE: 176 LQFP; SUPPLIER: STMicroelectronics
U2 U4 U5 = ir2104:IR2104STRPBF: HALF-BRIDGE DRIVER; MPN: IR2104STRPBF; OC_FARNELL: 1795566; OC_NEWARK: 40M8006; PACKAGE: SOIC-8; SUPPLIER: INTERNATIONAL RECTIFIER
U3 = 1_Robo-Lib:TSR_1-*: TRACO TSR-1 Series Point-of-Load DC/DC-Converters Vi max. 36 V; Vo = (1.2 .. 15)V ±2%; Io = 0 .. 1 A SIP-Package (drop-in replacement for 78xx linear voltage regulators in TO220-package, vertically assembled) Source: www.tracopower.com Technologies: TSR 1- Vi (V) Vo (V) ±2% Io = 0 .. 1 A 24_ ( generic ) 2412 4.6 .. 36 1.2 2415 4.6 .. 36 1.5 2418 4.6 .. 36 1.8 2425 4.6 .. 36 2.5 2433 4.75.. 36 3.3 2450 6.5 .. 36 5.0 2465 9.0 .. 36 6.5 2490 12 .. 36 9.0 24120 15 .. 36 12 24150 18 .. 36 15 Author: Dipl.-Ing. FH Rainer Bayer HHN Hochschule Heilbronn, rainer.bayer@hs-heilbronn.de Ingenieurbüro ing-rb, mail@ing-rb.de
U$1 = eigenes:ESP8266
U$2 = RPI-Zero:RPI-ZERO
U$3-U$8 = eigenes:IRLR7843
X1 = con-weidmueller-sl35:90-3: WEIDMUELLER CLAMP CONNECTOR; OC_FARNELL: unknown; OC_NEWARK: unknown

## Net classes
0 default: width 0.406 mm, clearance 0.106 mm
1 power: width 1.143 mm